# EAGLE design BRD161002 (EAGLE 7.6.0)
REV: R0.0x; TITLE: Battery pack 3xA
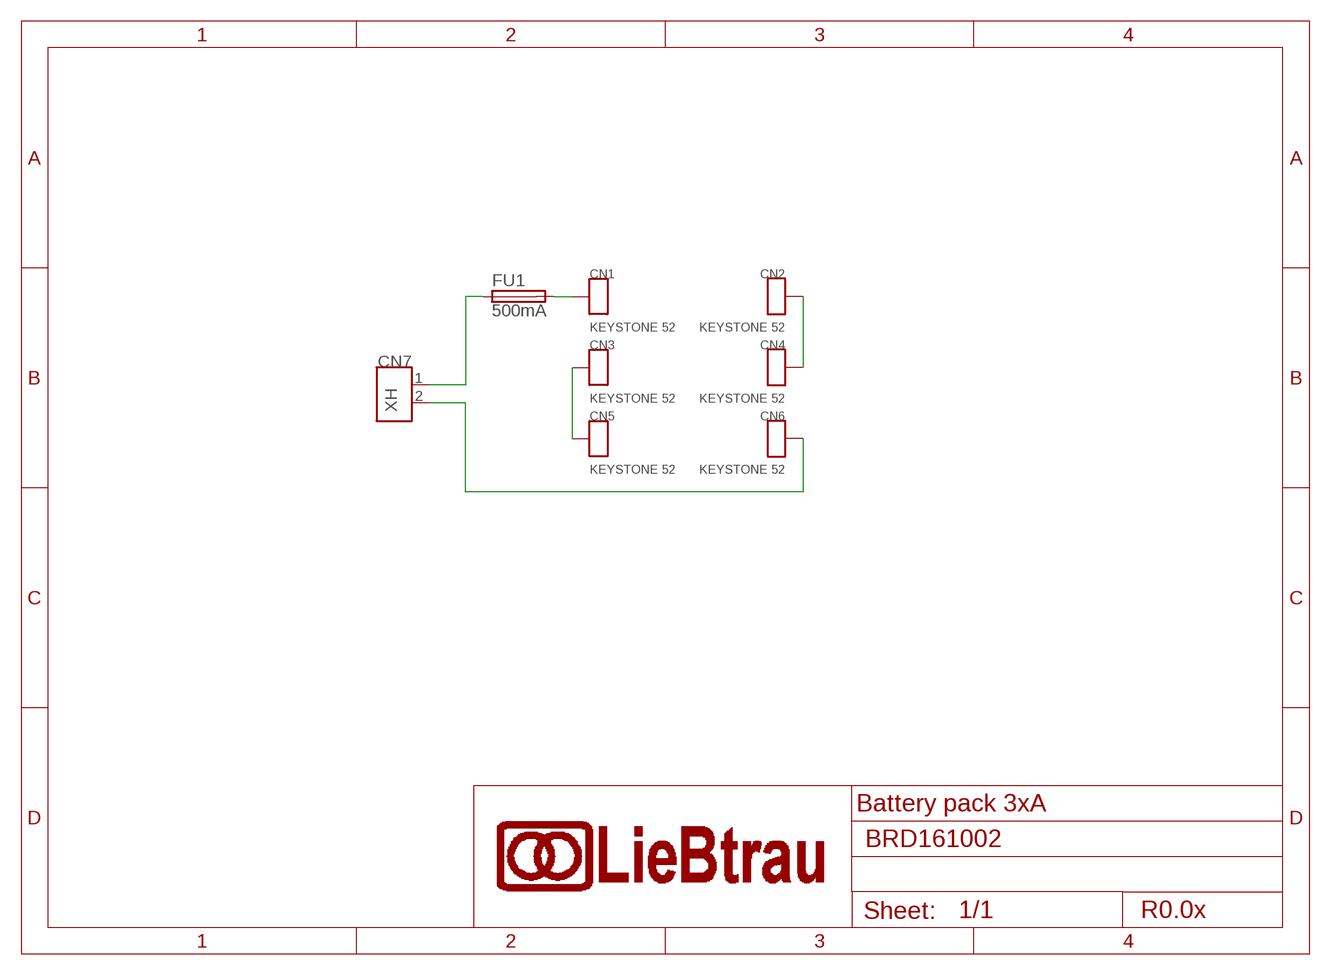
[diagram p0: schematic, sheet 1]

## Parts
CN1  KEYSTONE 52  CN_1P_BATTERY_CLIP_A_AA_KEYSTONE_52  [CN_BATTERY_CLIP_A_AA]
CN2  KEYSTONE 52  CN_1P_BATTERY_CLIP_A_AA_KEYSTONE_52  [CN_BATTERY_CLIP_A_AA]
CN3  KEYSTONE 52  CN_1P_BATTERY_CLIP_A_AA_KEYSTONE_52  [CN_BATTERY_CLIP_A_AA]
CN4  KEYSTONE 52  CN_1P_BATTERY_CLIP_A_AA_KEYSTONE_52  [CN_BATTERY_CLIP_A_AA]
CN5  KEYSTONE 52  CN_1P_BATTERY_CLIP_A_AA_KEYSTONE_52  [CN_BATTERY_CLIP_A_AA]
CN6  KEYSTONE 52  CN_1P_BATTERY_CLIP_A_AA_KEYSTONE_52  [CN_BATTERY_CLIP_A_AA]
CN7  XH  CN_2P_JST_B2B-XH_JST_B2B-XH  [CN_HDR1X2_180D_P25_JST_B2B-XH]
FU1  500mA  FU_POLY_500MA_FU_1812  [FU_1812]

## Nets
N$1: CN7.1 FU1.1
N$2: CN2.1 CN2.2 CN4.1 CN4.2
N$3: CN3.1 CN3.2 CN5.1 CN5.2
N$4: CN6.1 CN6.2 CN7.2
N$5: CN1.1 CN1.2 FU1.2

## Library data of the parts
CN1-CN6 = lieBtrau:CN_1P; COST: 0.30; ORDERCODE: DK 36-52-ND
CN7 = lieBtrau:CN_2P; COST: 0.13; ORDERCODE: 455-2247-ND
FU1 = lieBtrau:FU; COST: 0.12; ORDERCODE: 507-1762-1-ND

## Board
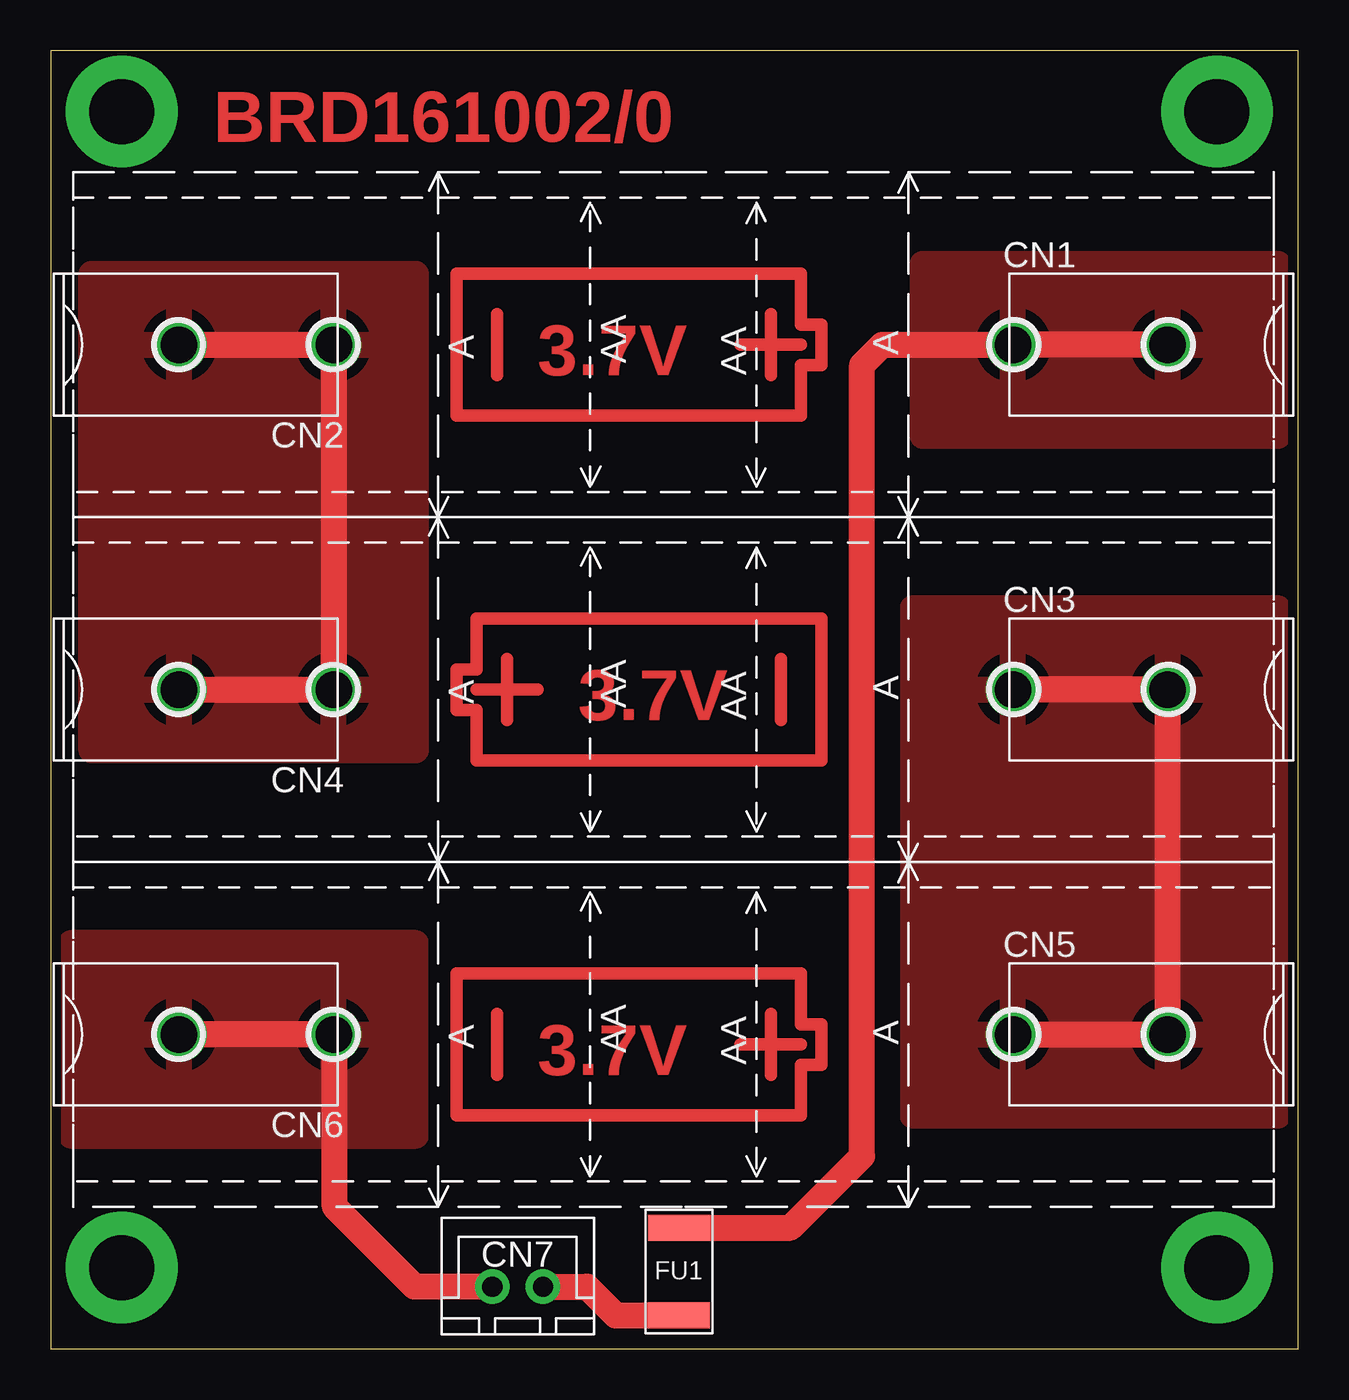
[diagram p1: board, top side]
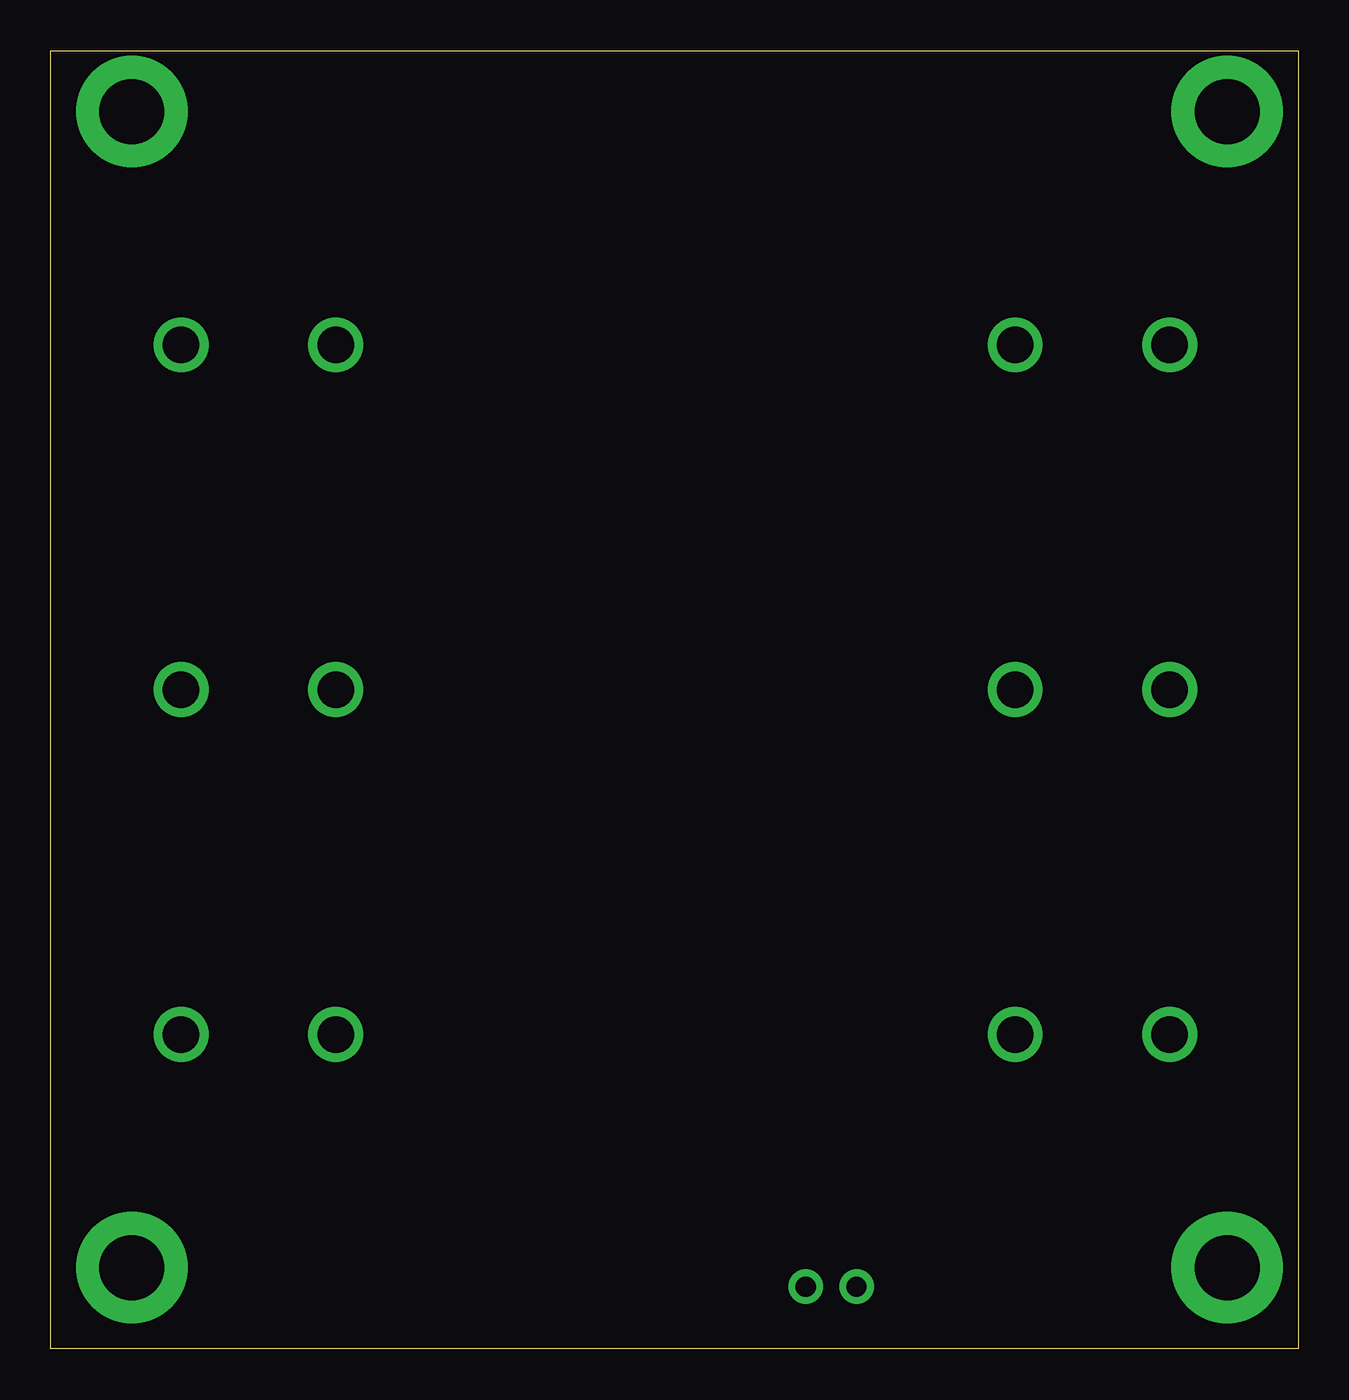
[diagram p2: board, bottom side, seen from below]

Size 61.5 x 64 mm. Coordinates in mm from the lower left corner, seen from the top.
Outline: 0,0 61.5,0 61.5,64 0,64 0,0
Copper layers (1*16): Top 0.035mm / dielectric 1.5mm / Bottom 0.035mm
Design rules "dtron": minimum track width 0.175mm, minimum drill 0.6mm, track to track 0.25mm, track to pad 0.25mm, pad to pad 0.2mm, via to via 0.25mm, smd to smd 0.2mm, copper to edge 0.5mm, drill to drill 0.2mm, minimum pad ring 0.25mm, minimum via ring 0.2mm, stop-mask expansion 0.1mm, vias tented up to drill 0mil, thermal gap 0.5mm

### Footprints (pad centres in the part's own frame; a part is rotated, then mirrored left to right if it is on the bottom)
CN_BATTERY_CLIP_A_AA = drill 1.8 pad 2.6: 1 41.15,0; 2 48.77,0
CN_HDR1X2_180D_P25_JST_B2B-XH = drill 1 pad 1.7: 1 -1.25,0; 2 1.25,0
FU_1812 = smd 1.27 x 3.048: 1 -2.159,0; 2 2.159,0

### Placement (x,y rotation side)
CN1  6.3,49.5 0 top
CN2  55.1,49.5 180 top
CN3  6.3,32.5 0 top
CN4  55.1,32.5 180 top
CN5  6.3,15.5 0 top
CN6  55.1,15.5 180 top
CN7  23.02,3.06 180 top
FU1  30.98,3.81 90 top
U$2  [FR_FRAME_A5]  -61.5,-41 0 top  (outside the outline)

### Tracks (layer width: path | path; a pad name or v marks a point on that pad's centre or on a via)
N$1
  Top 1.27: CN7.1 26.44,3.06 27.85,1.65 FU1.1
N$2
  Top 1.27: CN2.2 CN2.1 CN4.1 CN4.2
  pour Top: 2,53 18,53 18,29.5 2,29.5
N$3
  Top 1.27: CN5.1 CN5.2 CN3.2 CN3.1
  pour Top: 42.5,36.5 42.5,11.5 60.5,11.5 60.5,36.5
N$4
  Top 1.27: CN6.2 CN6.1 14,15.45 14,7 17.94,3.06 CN7.2
  pour Top: 1,20 1,10.5 18,10.5 18,20
N$5
  Top 1.27: CN1.2 CN1.1 41,49.5 40,48.5 40,9.5 36.47,5.97 FU1.2
  pour Top: 43,53.5 60.5,53.5 60.5,45 43,45
N$6  (via drill 3.2 pad 5.5)
  other vias: 57.5,4
N$7  (via drill 3.2 pad 5.5)
  other vias: 3.5,4
N$8  (via drill 3.2 pad 5.5)
  other vias: 57.5,61
N$9  (via drill 3.2 pad 5.5)
  other vias: 3.5,61
N$10
  Top 0.61: 35.5,49.5 37,49.5 | 35.5,51 35.5,49.5 | 35.5,49.5 35.5,48 | 34,49.5 35.5,49.5
N$12
  Top 0.61: 22,51 22,48
N$13
  Top 0.61: 20,53 20,46 37,46 37,48.5 38,48.5 38,50.5 37,50.5 37,53 20,53
N$14
  Top 0.61: 35.5,15 37,15 | 35.5,16.5 35.5,15 | 35.5,15 35.5,13.5 | 34,15 35.5,15
N$16
  Top 0.61: 22,16.5 22,13.5
N$17
  Top 0.61: 20,18.5 20,11.5 37,11.5 37,14 38,14 38,16 37,16 37,18.5 20,18.5
N$18
  Top 0.61: 24,32.5 22.5,32.5 | 22.5,32.5 21,32.5 | 22.5,32.5 22.5,34 | 22.5,31 22.5,32.5
N$20
  Top 0.61: 36,31 36,34
N$21
  Top 0.61: 38,29 38,36 21,36 21,33.5 20,33.5 20,31.5 21,31.5 21,29 38,29

### Text on the board
Top: BRD161002/0 | 3.7V | 3.7V | 3.7V